# Altium schematic sheet Power_Supply_and_Buttons.SchDoc
size A4
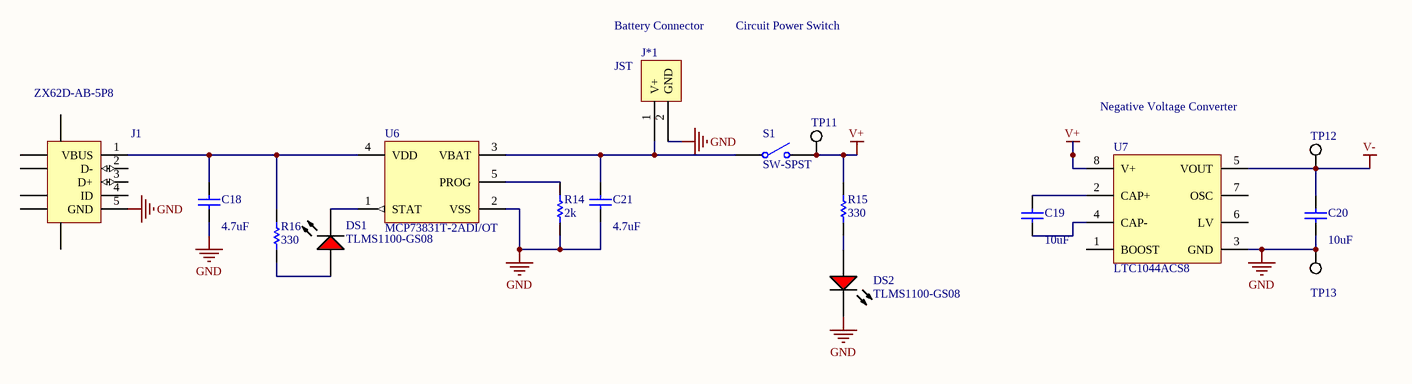
[diagram p0: Power_Supply_and_Buttons.SchDoc]

## Parts
C18  4.7uF  [1608[0603]]
C19  10uF  [1608[0603]]
C20  10uF  [1608[0603]]
C21  4.7uF  [1608[0603]]
DS1  TLMS1100-GS08  [VISH-TLMX1100_V]
DS2  TLMS1100-GS08  [VISH-TLMX1100_V]
J1  ZX62D-AB-5P8  [HIRO-ZX62D-AB-5P8_V]
J*1  JST  [JST- S2B-PH-SM4-TB(LF)(SN)-2_V]
R14  2k  [6-0805_M]
R15  330  [6-0805_M]
R16  330  [6-0805_M]
S1  SW-SPST  [SPST-2]
TP11  TESTPOINT_WHITE  [TestPointVia]  (value not drawn)
TP12  TESTPOINT_WHITE  [TestPointVia]  (value not drawn)
TP13  TESTPOINT_WHITE  [TestPointVia]  (value not drawn)
U6  MCP73831T-2ADI/OT  [SOT-23-OT5_M]
U7  LTC1044ACS8  [LT-S8-8_M]

## Nets
GND: C18.1 C20.1 C21.1 DS2.2(K) J1.5(GND) J*1.2(GND) R14.1 TP13.1 U6.2(VSS) U7.3(GND)
V+: R15.2 S1.2(NO) TP11.1 U7.8(V+)
V-: C20.2 TP12.1 U7.5(VOUT)
NetC18_2: C18.2 J1.1(VBUS) R16.2 U6.4(VDD)
NetC19_1: C19.1 U7.4(CAP-)
NetC19_2: C19.2 U7.2(CAP+)
NetC21_2: C21.2 J*1.1(V+) S1.1(COMMON) U6.3(VBAT)
NetDS1_1: DS1.1(A) R16.1
NetDS1_2: DS1.2(K) U6.1(STAT)
NetDS2_1: DS2.1(A) R15.1
NetR14_2: R14.2 U6.5(PROG)

Not connected (* = marked no-connect by the designer): J1 2(D-) 3(D+) 4(ID) 6(SHLD) 7(SHLD) 8(SHLD) 9(SHLD) 10(SHLD) 11(SHLD); U7 1(BOOST) 6(LV) 7(OSC)

## Notes on the sheet
- Battery Connector
- Circuit Power Switch
- Negative Voltage Converter

## Library data of the parts
C18-C21 = Cap Semi: Capacitor (Semiconductor SIM Model); Published: 8-Jun-2000; LatestRevisionDate: 29-May-2009; LatestRevisionNote: IPC-7351 Footprint Added.; PackageReference: C1206; Publisher: Altium Limited; PackageDescription: Chip Capacitor
  C18 C21: Value: 4.7uF
  C19 C20: Value: 10uF
DS1 DS2 = CMP-1666-00027-1: LED, RED, 2.1 V, -40 to 100 degC, 2-Pin SMD (0603), RoHS, Tape and Reel; Type (Capacitors): C0G; Resistance: 100000000000 Ohm; Capacitance: 12 pF; Voltage Rating: 50 V; Tolerance: 5%; Min Operating Temperature: -55degC; REACH SVHC: No SVHC; ComponentLink2Description: Datasheet; ComponentLink1URL: http://www.vishay.com/; Width: 0.8 mm; Package Quantity: 4000; PackageReference: TLMX1100; ComponentLink2URL: http://www.vishay.com/docs/83173/tlmb1100.pdf; Case/Package: 0603; Case Code (Metric): 1608; Packaging: Tape and Reel; Pins: 2; ComponentLink1Description: Manufacturer URL; Max Operating Temperature: 125degC; Height: 0.8 mm; Length: 1.6 mm; Mount: Surface Mount; PackageDescription: 2-Pin Surface Mount Device, Body 1.6 x 0.8 mm; DatasheetVersion: Rev. 2.7, 03/2016; Case Code (Imperial): 0603; Voltage Rating (DC): 50 V; RoHSCompliant: True; Radiation Hardening: No
J1 = CMP-1349-00001-2: USB 2.0 Standard Micro-USB Connector, Micro AB-Standard (Bottom Mount), 30 V AC, -30 to 85 degC, Right Angle, 5-Pin 7.5 x 5.6 x 2.8 mm SMD, RoHS, Reel; Manufacturer: Hirose Electric; Number of Contacts: 5; Capacitance: 2 pF Max.; Voltage Rating: 30 V AC; Contact Resistance: 30 mOhm Max.; PartNumber: ZX62D-AB-5P8; Mounting Technology: Surface Mount; ComponentLink1URL: http://www.hirose.com/; ComponentLink2URL: http://www.hirose.co.jp/cataloge_hp/ed_ZX_20140804.pdf; ComponentLink1Description: Manufacturer URL; ComponentLink3Description: Package Specification; Operating Temperature Range: -30 to 85 degC; RoHS: TRUE; DatasheetVersion: Aug-14; PackageDescription: USB Micro-AB Connector, Right Angle, Body 7.5 x 5.6 mm, Pitch 0.65 mm, Height 2.8 mm; ComponentLink3URL: http://www.hirose.co.jp/cataloge_hp/ed_ZX_20140804.pdf; Packing: Reel; ComponentLink2Description: Datasheet
R14-R16 = Res1: Resistor; Published: 8-Jun-2000; LatestRevisionDate: 17-Jul-2002; LatestRevisionNote: Re-released for DXP Platform.; PackageReference: AXIAL-0.3; Publisher: Altium Limited; PackageDescription: Axial Device, Thru-Hole; 2 Leads; 0.3 in Pin Spacing
  R14: Value: 2k
  R15 R16: Value: 330
S1 = SW-SPST: Single-Pole, Single-Throw Switch; Published: 24-Mar-1999; LatestRevisionDate: 17-Jul-2002; LatestRevisionNote: Re-released for DXP Platform.; PackageReference: SPST-2; Publisher: Altium Limited; PackageDescription: Switch; 2 Leads
U6 = CMP-0133-00142-1: Miniature Single-Cell, Fully Integrated Li-Ion, Li-Polymer Charge Management Controller, 4.2V, 5-Pin SOT-23, Industrial Temperature, Tape and Reel; PackageVersion: revBB, Aug-2009; DatasheetVersion: revE, Sep-2008; PackageDescription: 5-Lead Plastic Small Outline Transistor (OT) [SOT-23]; PackageReference: SOT-23-OT5; Code_IPC: SOT23-5
U7 = CMP-0475-00491-1: 12 V CMOS Voltage Converter, 8-pin SOIC (S8-8), 0 to 70 degC; Manufacturer: Linear Technology; Isupply(mA): 0.2; Voutput: 2Vin, -Vin, 0.5Vin; Vin Max(V): 12; Frequency(kHz): 5; Max Iout(mA): 20; Vin Min(V): 1.5; ComponentLink1Description: Manufacturer URL; PartNumber: LTC1044ACS8; PackageVersion: Rev. G, 03/2012; ComponentLink2URL: http://cds.linear.com/docs/en/datasheet/lt1044a.pdf; PackageReference: S8-8; ComponentLink2Description: Datasheet; DatasheetVersion: Rev. 0; RoHS: FALSE; PackageDescription: 8-Pin Plastic Small Outline (Narrow .150 Inch), Body 4.9 x 3.9 mm, Pitch 1.27 mm; ComponentLink3Description: Package Specification; Mounting Technology: Surface Mount; ComponentLink3URL: http://cds.linear.com/docs/en/packaging/05081610_G_SO8.pdf; ComponentLink1URL: http://www.linear.com/